# Altium schematic sheet pwr_regulator.SchDoc
size Letter; SheetNumber: 1; SheetTotal: 1
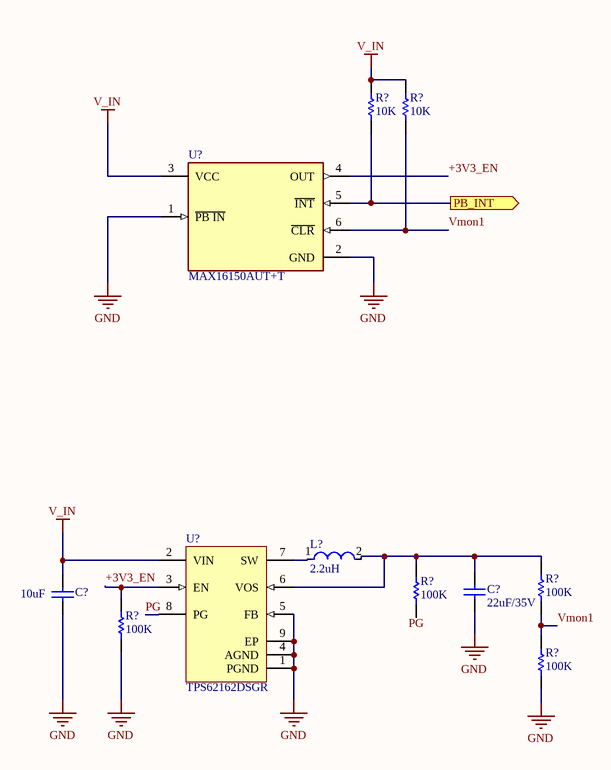
[diagram p0: pwr_regulator.SchDoc]

## Parts
(Parts that share a designator on the sheet are numbered #1, #2 ... from top to bottom, then left to right.)
C?#1  10uF  [KEMT-1206-2_M]
C?#2  22uF/35V  [KEMT-1206-2_M]
L?  2.2uH  [FP-LQH31CN_03-MFG]
R?#1  10K  [RESC3216X70X50NL05T20]
R?#2  10K  [RESC3216X70X50NL05T20]
R?#3  100K  [RESC3216X70X50NL05T20]
R?#4  100K  [RESC3216X70X50NL05T20]
R?#5  100K  [RESC3216X70X50NL05T20]
R?#6  100K  [RESC3216X70X50NL05T20]
U?#1  MAX16150AUT+T  [FP-U6-1-MFG]
U?#2  TPS62162DSGR  [DSG0008A_V]

## Ports
PB_INT (out)

## Nets
GND: C?#1.1 C?#2.1 R?#5.1 R?#6.1 U?#1.1(~{PB_IN}) U?#1.2(GND) U?#2.1(PGND) U?#2.4(AGND) U?#2.5(FB) U?#2.9(EP)
V_IN: C?#1.2 R?#1.2 R?#2.2 U?#1.3(VCC) U?#2.2(VIN)
+3V3_EN: R?#5.2 U?#1.4(OUT) U?#2.3(EN)
PB_INT: R?#1.1 U?#1.5(~{INT}) ; port PB_INT
PG: U?#2.8(PG)
Vmon1: R?#2.1 R?#4.1 R?#6.2 U?#1.6(~{CLR})
NetC?#2_2: C?#2.2 L?.2 R?#3.2 R?#4.2 U?#2.6(VOS)
NetL?_1: L?.1 U?#2.7(SW)

Not connected (* = marked no-connect by the designer): R?#3 1

## Notes on the sheet
- Labels drawn without touching a wire or pin: PG

## Library data of the parts
C?#1 C?#2 = CMP-1037-04202-2: CAP, Ceramic, 0.1 uF, +/- 10%, 50 V, -55 to 125 degC, 1206 (3216 Metric), RoHS, Tape and Reel; Manufacturer: Kemet; Voltage Rating: 50V; Capacitance: 0.1µF; Product Range: KEMET-CSeries; SVHC: ToBeAdvised; Dielectric Characteristic: X7R; Capacitor Case Style: 1206[3216Metric]; Package Reference: 1206-2; Package Description: 2-Leads SMD, Body 3.2 x 1.6 mm; Packaging: Tape&Reel; Operating Temperature Max: 125degC; Capacitance Tolerance: ±10%; Datasheet URL: https://datasheet.ciiva.com/6125/1725438-6125494.pdf; Manufacturer URL: http://www.kemet.com/; Operating Temperature Min: -55degC; Datasheet Version: Jul-13
L? = CMP-06042-002030-1: Wire Wound Ferrite Inductor for General Circuits 56μH ±10% 11.57Ω 50mA 1206; Self Resonant Frequency: 9MHz; Shielding: Unshielded; Test Frequency: 1MHz; DC Resistance (DCR): 8.9R; Inductance: 56uH; Q Factor: 40; Case/Package: 1206; Inductance Tolerance: 10%; Min Operating Temperature: -25°C; DC Current: 50mA; Case Code (Imperial): 1206; Weight: 0.001023oz; Tolerance: 10%; Length: 0.126inch; Mount: Surface Mount; Package Quantity: 2000; Depth: 1.8mm; Max DC Current: 50mA; Packaging: Tape and Reel; Height - Seated (Max): 0.079inch; Core Material: Ferrite; REACH SVHC: No SVHC; Current Rating: 50mA; Case Code (Metric): 3216; Radiation Hardening: No; Resistor Type: Wirewound; Number of Pins: 2; Termination: SMD/SMT; Military Standard: Not; Width: 1.6mm; Height: 0.071inch; Max Operating Temperature: 85°C
R?#1-R?#6 = CMP-2003-00541-1: Manufacturer: Panasonic; Part Number: ERJ-8GEY0R00V
U?#1 = CMP-05723-001129-1: IC SUPERVISOR 1 CHANNEL SOT23-6
U?#2 = CMP-0323-00316-3: Buck Step Down Regulator with 3 to 17 V Input and 3.3 V Output, -40 to 85 degC, 8-Pin WSON (DSG), Green (RoHS & no Sb/Br); Manufacturer: Texas Instruments; SubFamily: Step-Down Regulator; Synchronous Rectification: TRUE; Vout(Max)(V): 3.3; Regulated Outputs(#): 1; Switch Current Limit(Typ)(A): 1.8; Duty Cycle(Max)(%): 100; Iq(Typ)(mA): 0.017; Rating: Catalog; Vin(Min)(V): 3; Vin(Max)(V): 17; ComponentLink2URL: http://www.ti.com/litv/pdf/mpds308a; ComponentLink3URL: Samples URL:http://www.ti.com/product/tps62162#samples; Eco-Plan: Green (RoHS & no Sb/Br); PackageDescription: 8-Pin Plastic Small Outline No-Lead, 2 x 2 x 0.8 mm Body, 0.5 mm Pitch, Exposed Pad; DatasheetVersion: SLVSAM2A; Topology: Buck; PartNumber: TPS62162DSGR; PackageReference: DSG0008A; ComponentLink1URL: http://www.ti.com/general/docs/lit/getliterature.tsp?genericPartNumber=TPS62162&fileType=pdf; PackageVersion: revB, Oct-2010; Mounting Technology: Surface Mount; Code_JEDEC: MO-229; Iout(Max)(A): 1; ComponentLink1Description: Datasheet; ComponentLink2Description: Package Specification; Vout(Min)(V): 3.3; ComponentLink3Description: URL Link1; Preset Vout(V): 3.3